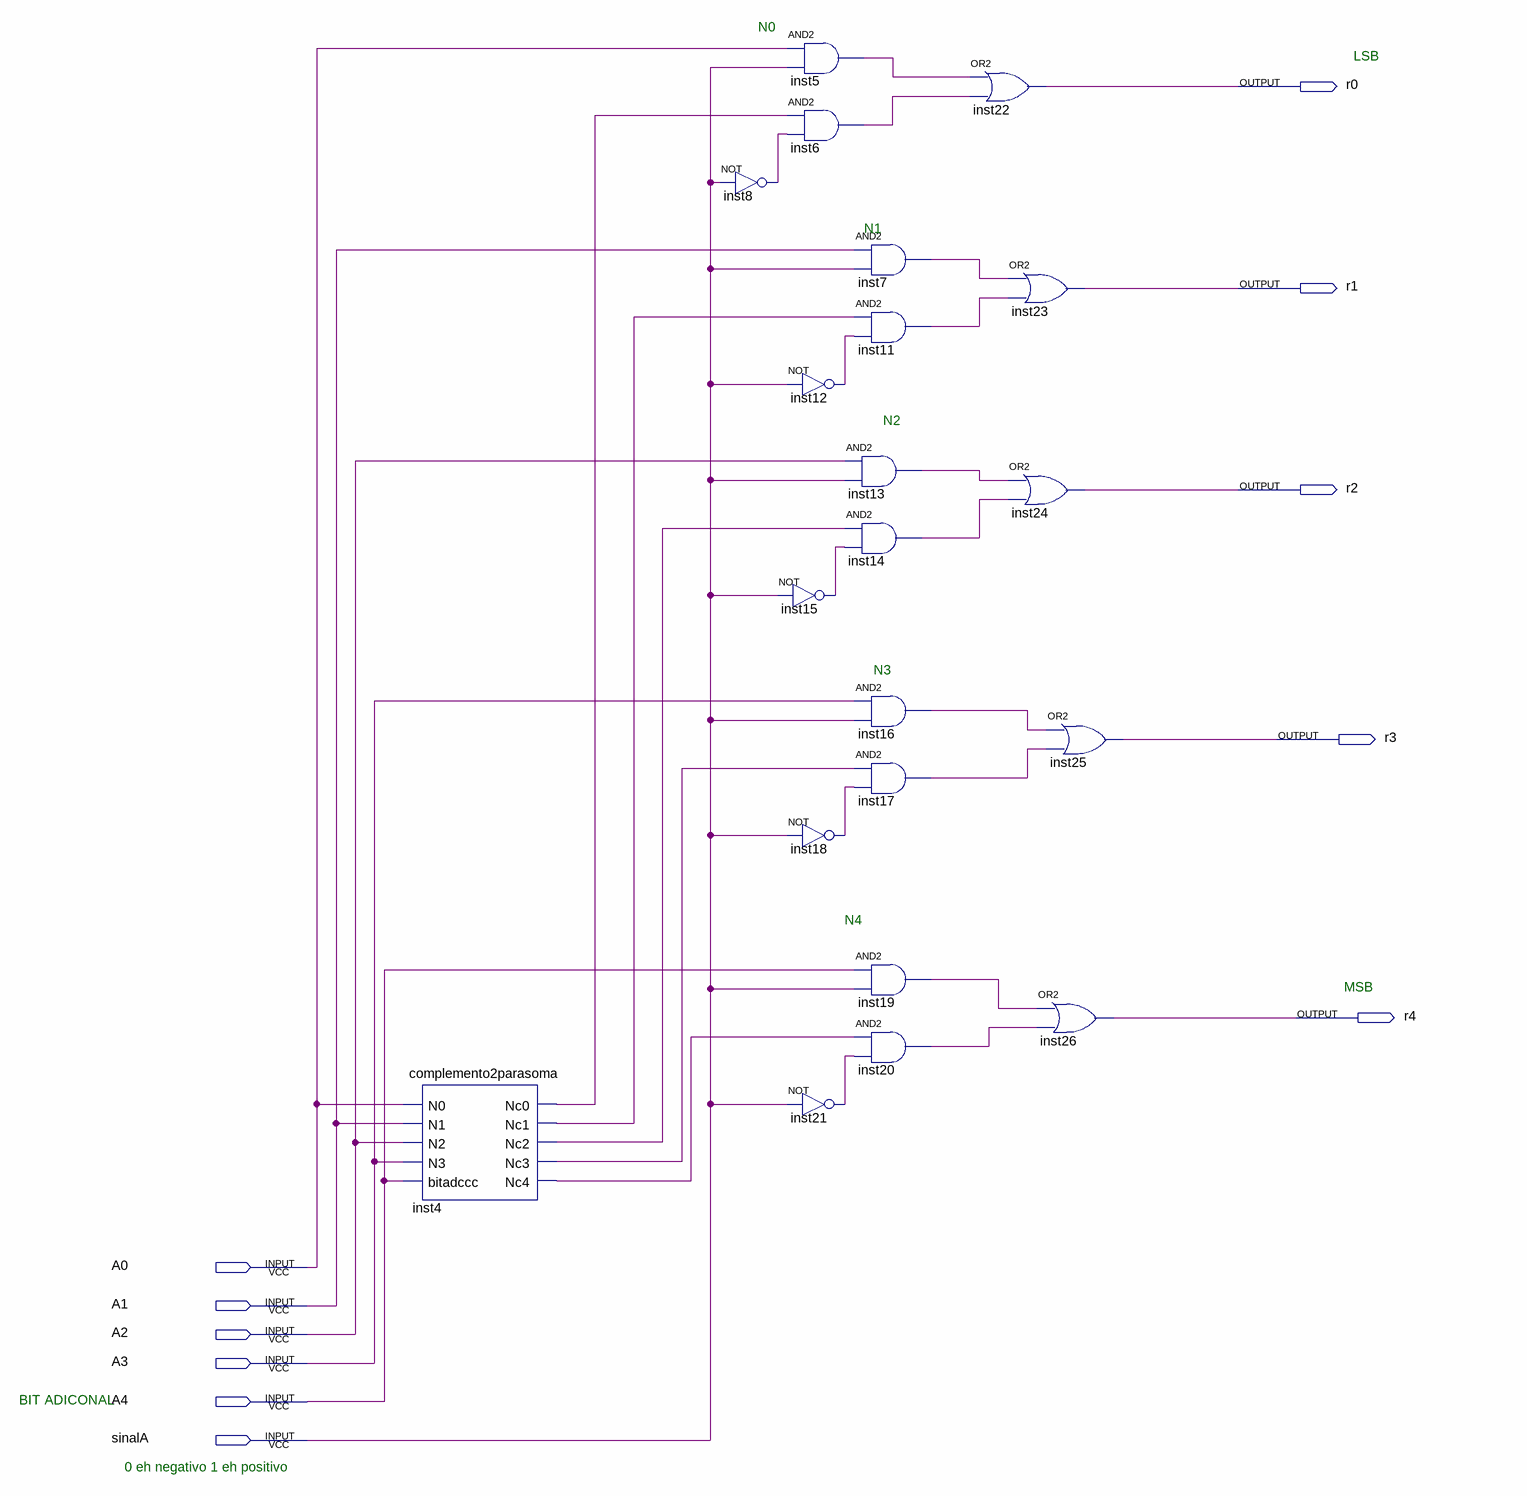
[diagram p0: schematic sheet]
// Quartus schematic A_ou_Ac2.bdf as structural Verilog: 21 symbols, 11 pins
module A_ou_Ac2 (
  input  A0,
  input  A1,
  input  A2,
  input  A3,
  input  A4,
  input  sinalA,
  output r0,
  output r1,
  output r2,
  output r3,
  output r4
);

  wire inst4_nc0, inst4_nc1, inst4_nc2, inst4_nc3, inst4_nc4, inst5_out, inst6_out, inst7_out, inst8_out,
       inst11_out, inst12_out, inst13_out, inst14_out, inst15_out, inst16_out, inst17_out, inst18_out,
       inst19_out, inst20_out, inst21_out;

  complemento2parasoma inst4 (
    .N0(A0), .N1(A1), .N2(A2), .N3(A3), .bitadccc(A4), .Nc0(inst4_nc0), .Nc1(inst4_nc1), .Nc2(inst4_nc2),
    .Nc3(inst4_nc3), .Nc4(inst4_nc4));
  not inst8 (inst8_out, sinalA);
  and inst5 (inst5_out, A0, sinalA);
  and inst6 (inst6_out, inst4_nc0, inst8_out);
  not inst12 (inst12_out, sinalA);
  not inst15 (inst15_out, sinalA);
  not inst18 (inst18_out, sinalA);
  not inst21 (inst21_out, sinalA);
  and inst7 (inst7_out, A1, sinalA);
  and inst11 (inst11_out, inst4_nc1, inst12_out);
  and inst13 (inst13_out, A2, sinalA);
  and inst14 (inst14_out, inst4_nc2, inst15_out);
  and inst16 (inst16_out, A3, sinalA);
  and inst17 (inst17_out, inst4_nc3, inst18_out);
  and inst19 (inst19_out, A4, sinalA);
  and inst20 (inst20_out, inst4_nc4, inst21_out);
  or inst22 (r0, inst5_out, inst6_out);
  or inst23 (r1, inst7_out, inst11_out);
  or inst24 (r2, inst13_out, inst14_out);
  or inst26 (r4, inst19_out, inst20_out);
  or inst25 (r3, inst16_out, inst17_out);

  // Notes on the sheet:
  //   N0
  //   LSB
  //   N1
  //   N2
  //   N3
  //   N4
  //   MSB
  //   BIT ADICONAL
  //   0 eh negativo 1 eh positivo
endmodule
